# EAGLE schematic optics_r001 (EAGLE 7.7.0)
AUTHOR: Joshua Alexander; REVISION: R001
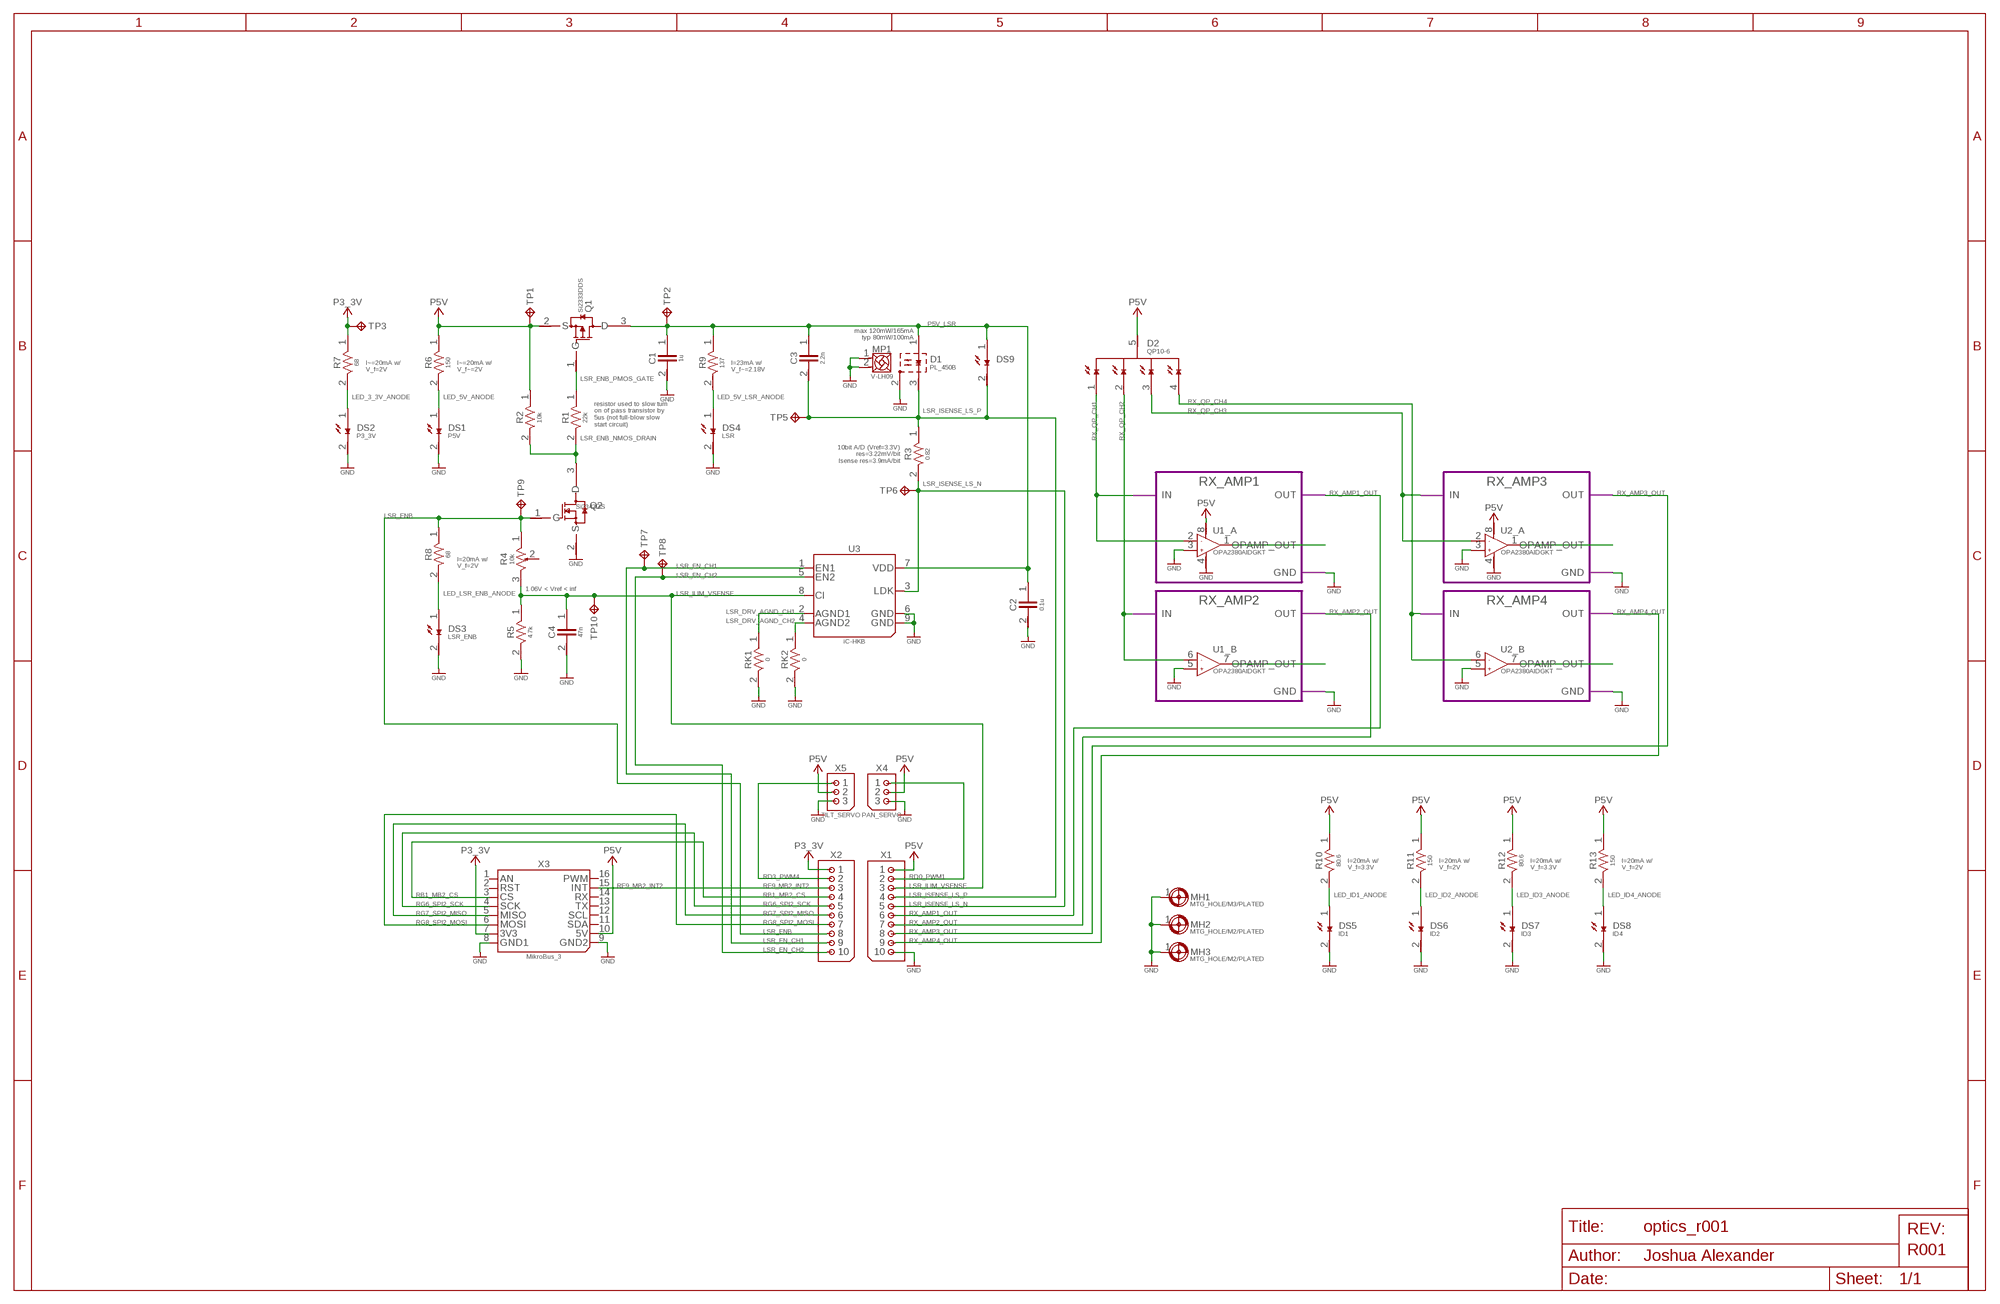
[diagram p0: schematic, sheet 1]

## Parts
C1  1u  C/10%/0805/10V  [0805_WAVE]
C2  0.1u  C/5%/0805/10V  [0805_WAVE]
C3  2.2n  C/1%/0805/10V  [0805_WAVE]
C4  47n  C/5%/0805/10V  [0805_WAVE]
D1  PL_450B  [TO38-ICUT-PL_450B]
D2  QP10-6  [TO5-QP10-6]
DS1  P5V  LED/YELLOW/1206/KINGBRIGHT  [1206_WAVE]
DS2  P3_3V  LED/YELLOW/1206/KINGBRIGHT  [1206_WAVE]
DS3  LSR_ENB  LED/RED/1206/KINGBRIGHT  [1206_WAVE]
DS4  LSR  LED/YELLOW/1206/KINGBRIGHT  [1206_WAVE]
DS5  ID1  LED/BLUE/1206/KINGBRIGHT  [1206_WAVE]
DS6  ID2  LED/RED/1206/KINGBRIGHT  [1206_WAVE]
DS7  ID3  LED/BLUE/1206/KINGBRIGHT  [1206_WAVE]
DS8  ID4  LED/YELLOW/1206/KINGBRIGHT  [1206_WAVE]
DS9  LED/BLUE/TH/5MM/CREE  [C503B-BAN/GAN/BCN/GCN]
MH1  MTG_HOLE/M3/PLATED  [M3_PLATED]
MH2  MTG_HOLE/M2/PLATED  [M2_PLATED]
MH3  MTG_HOLE/M2/PLATED  [M2_PLATED]
MP1  LENS_HOLDER/M9/LOW-PROFILE  [V-LH09]
Q1  MOSFET_P-TYPE/SI2333DDS  [SOT23-3]
Q2  MOSFET_N-TYPE/SI2342DS  [SOT23-3]
R1  22k  R/1%/0805/0.125W  [0805_WAVE]
R2  10k  R/1%/0805/0.125W  [0805_WAVE]
R3  0.82  R_SENSE/1%/1206/0.5W  [1206_WAVE]
R4  10k  R_POT/T93YB  [T93YB]
R5  4.7k  R/1%/0805/0.125W  [0805_WAVE]
R6  150  R/1%/0805/0.125W  [0805_WAVE]
R7  68  R/1%/0805/0.125W  [0805_WAVE]
R8  68  R/1%/0805/0.125W  [0805_WAVE]
R9  137  R/1%/0805/0.125W  [0805_WAVE]
R10  80.6  R/1%/0805/0.125W  [0805_WAVE]
R11  150  R/1%/0805/0.125W  [0805_WAVE]
R12  80.6  R/1%/0805/0.125W  [0805_WAVE]
R13  150  R/1%/0805/0.125W  [0805_WAVE]
RK1  0  R/1%/0805/0.125W  [0805_WAVE]
RK2  0  R/1%/0805/0.125W  [0805_WAVE]
TP1  TP/RECT_5X2.5  [PAD_RECT_5X2.5]
TP2  TP/RECT_5X2.5  [PAD_RECT_5X2.5]
TP3  TP/RECT_5X2.5  [PAD_RECT_5X2.5]
TP5  TP/CIRCLE_1.5  [PAD_CIRCLE_1.5]
TP6  TP/CIRCLE_1.5  [PAD_CIRCLE_1.5]
TP7  TP/OVAL_3X1.5  [PAD_OVAL_3X1.5]
TP8  TP/OVAL_3X1.5  [PAD_OVAL_3X1.5]
TP9  TP/CIRCLE_2  [PAD_CIRCLE_2]
TP10  TP/CIRCLE_1.5  [PAD_CIRCLE_1.5]
U1  OPA2380  [MSOP8]
U2  OPA2380  [MSOP8]
U3  iC-HKB  IC-HKB  [MSOP8-TP]
X1  HEADER-1X10/MALE/100MIL/TH/BREAKAWAY  [90120-0130]
X2  HEADER-1X10/MALE/100MIL/TH/BREAKAWAY  [90120-0130]
X3  MikroBus_3  MIKROE_BUS_CONN/SOCKET/NO_OUTLINE/COMPACT  [MIKROBUS_SOCKET_NO_OUTLINE_COMPACT]
X4  PAN_SERVO  HEADER-1X03/MALE/100MIL/TH/BREAKAWAY  [22-28-4030]
X5  TILT_SERVO  HEADER-1X03/MALE/100MIL/TH/BREAKAWAY  [22-28-4030]

## Module instances
RX_AMP1 = RX_AMP (part numbers offset by 100)
RX_AMP2 = RX_AMP (part numbers offset by 200)
RX_AMP3 = RX_AMP (part numbers offset by 300)
RX_AMP4 = RX_AMP (part numbers offset by 400)

## Nets
GND: C1.2 C2.2 C4.2 D1.2(CASE) DS1.2(C) DS2.2(C) DS3.2(C) DS4.2(C) DS5.2(C) DS6.2(C) DS7.2(C) DS8.2(C) MH1.1 MH2.1 MH3.1 MP1.1 MP1.2 Q2.2(S) R5.2 RK1.2 RK2.2 U1.3(_A:+IN) U1.4(V-) U1.5(_B:+IN) U2.3(_A:+IN) U2.4(V-) U2.5(_B:+IN) U3.6(GND) U3.9(GND) X1.10 X3.8(GND1) X3.9(GND2) X4.3 X5.3 ; port RX_AMP3.GND RX_AMP4.GND RX_AMP1.GND RX_AMP2.GND
LED_3_3V_ANODE: DS2.1(A) R7.2
LED_5V_ANODE: DS1.1(A) R6.2
LED_5V_LSR_ANODE [LSR_EN_CH]: DS4.1(A) R9.2
LED_ID1_ANODE: DS5.1(A) R10.2
LED_ID2_ANODE: DS6.1(A) R11.2
LED_ID3_ANODE: DS7.1(A) R12.2
LED_ID4_ANODE: DS8.1(A) R13.2
LED_LSR_ENB_ANODE: DS3.1(A) R8.2
LSR_DRV_AGND_CH1: RK1.1 U3.2(AGND1)
LSR_DRV_AGND_CH2: RK2.1 U3.4(AGND2)
LSR_EN_CH1 [LSR_EN_CH]: TP7.1 U3.1(EN1) X2.9
LSR_EN_CH2 [LSR_EN_CH]: TP8.1 U3.5(EN2) X2.10
LSR_ENB: Q2.1(G) R4.1 R8.1 TP9.1 X2.8
LSR_ENB_NMOS_DRAIN: Q2.3(D) R1.2 R2.2
LSR_ENB_PMOS_GATE: Q1.1(G) R1.1
LSR_ILIM_VSENSE: C4.1 R4.3 R5.1 TP10.1 U3.8(CI) X1.3
LSR_ISENSE_LS_N: R3.2 TP6.1 U3.3(LDK) X1.5
LSR_ISENSE_LS_P: C3.2 D1.3(C) DS9.2(C) R3.1 TP5.1 X1.4
P3_3V [PWR]: R7.1 TP3.1 X2.1 X3.7(3V3)
P5V [PWR]: D2.5(C) Q1.2(S) R2.1 R6.1 R10.1 R11.1 R12.1 R13.1 TP1.1 U1.8(V+) U2.8(V+) X1.1 X3.10(5V) X4.2 X5.2
P5V_LSR [PWR]: C1.1 C2.1 C3.1 D1.1(A) DS9.1(A) Q1.3(D) R9.1 TP2.1 U3.7(VDD)
RB1_MB2_CS: X2.4 X3.3(CS)
RD0_PWM1: X1.2 X4.1
RD3_PWM4: X2.2 X5.1
RE9_MB2_INT2: X2.3 X3.15(INT)
RG6_SPI2_SCK: X2.5 X3.4(SCK)
RG7_SPI2_MISO: X2.6 X3.5(MISO)
RG8_SPI2_MOSI: X2.7 X3.6(MOSI)
RX_AMP1_OUT: X1.6 ; port RX_AMP1.OUT
RX_AMP2_OUT: X1.7 ; port RX_AMP2.OUT
RX_AMP3_OUT: X1.8 ; port RX_AMP3.OUT
RX_AMP4_OUT: X1.9 ; port RX_AMP4.OUT
RX_OPAMP_OUT1: U1.1(_A:OUT) ; port RX_AMP1.OPAMP_OUT
RX_OPAMP_OUT2: U1.7(_B:OUT) ; port RX_AMP2.OPAMP_OUT
RX_OPAMP_OUT3: U2.1(_A:OUT) ; port RX_AMP3.OPAMP_OUT
RX_OPAMP_OUT4: U2.7(_B:OUT) ; port RX_AMP4.OPAMP_OUT
RX_QP_CH1 [RX_AMP_PRE]: D2.1 U1.2(_A:-IN) ; port RX_AMP1.IN
RX_QP_CH2 [RX_AMP_PRE]: D2.2 U1.6(_B:-IN) ; port RX_AMP2.IN
RX_QP_CH3 [RX_AMP_PRE]: D2.3 U2.2(_A:-IN) ; port RX_AMP3.IN
RX_QP_CH4 [RX_AMP_PRE]: D2.4 U2.6(_B:-IN) ; port RX_AMP4.IN
Unconnected: R4.2(WIPER) X3.1(AN) X3.2(RST) X3.11(SDA) X3.12(SCL) X3.13(TX) X3.14(RX) X3.16(PWM)

## Notes on the sheet
- max 120mW/165mA
  typ 80mW/100mA
- I~=20mA w/
  V_f=2V
- I~=20mA w/
  V_f~=2V
- I=23mA w/
  V_f~=2.18V
- resistor used to slow turn
  on of pass transistor by
  5us (not full-blow slow
  start circuit)
- 10bit A/D (Vref=3.3V)
  res=3.22mV/bit
  Isense res=3.9mA/bit
- I=20mA w/
  V_f=2V
- 1.06V < Vref < inf
- I=20mA w/
  V_f=3.3V
- I=20mA w/
  V_f=2V
- I=20mA w/
  V_f=3.3V
- I=20mA w/
  V_f=2V

## Library data of the parts
C1 = rcl:C; EAGLEUP: C0805;;; TOL: 10
C2 C4 = rcl:C; EAGLEUP: C0805;;; TOL: 5
C3 = rcl:C; EAGLEUP: C0805;;; TOL: 1
D1 = diode:PL_450B: Blue Single-mode Laser Diode http://www.osram-os.com/osram_os/en/products/product-catalog/laser-diodes/visible-laser/blue-laser/index.jsp; EAGLEUP: PL_450B;;; I_F: 100mA; MFR: OSRAM; MPN: PL_450B; PWR: 0.08
D2 = diode:QP10-6: Quadrant PIN photodiode (QP) http://www.first-sensor.com/en/products/optical-sensors/detectors/quadrant-pin-photodiodes-qp/; ACTIVE_AREA_PER: 2.45mm^2; EAGLEUP: QP10-6; I_PEAK: 10mA; MFR: First Sensor; MPN: QP10-6; V_MAX: 20V
DS1 DS2 DS4 DS8 = diode:LED; ANGLE: 120; EAGLEUP: LED1206_YELLOW;;; I_F: 20mA; LUM: 150mcd; MFR: Kingbright; MPN: APT3216SYCK; V_F: 2
DS3 DS6 = diode:LED; ANGLE: 120; EAGLEUP: LED1206_RED;;; I_F: 20mA; LUM: 150mcd; MFR: Kingbright; MPN: APT3216SURCK; V_F: 1.95
DS5 DS7 = diode:LED; ANGLE: 120; EAGLEUP: LED1206_BLUE;;; I_F: 20mA; LUM: 100mcd; MFR: Kingbright; MPN: APT3216QBC/D; V_F: 3.3
DS9 = diode:LED; ANGLE: 30; EAGLEUP: LED5MM_GREEN;;DNI; I_F: 30mA; LUM: 7065mcd; MFR: Cree; MPN: C503B-BCN-CV0Z0461; V_F: 3.2
MH1-MH3 = mechanical:MTG_HOLE
MP1 = mechanical:LENS_HOLDER; EAGLEUP: V-LH09;;; MFR: Marshall; MPN: V-LH09
Q1 = transistor:MOSFET_P-TYPE: P-Channel MOSFET; EAGLEUP: SOT23-3;;; MFR: Vishay; MPN: Si2333DDS; R_DS: 0.033; V_DS: -12; V_GS: 8; V_GS_TH: -0.7
Q2 = transistor:MOSFET_N-TYPE: N-Channel MOSFET; EAGLEUP: SOT23-3;;; MFR: Vishay; MPN: Si2342DS; R_DS: 0.018; V_DS: 8; V_GS: 5; V_GS_TH: 0.575
R1 R2 R5-R13 RK1 RK2 = rcl:R; EAGLEUP: R0805;;; PWR: 0.125; TOL: 1
R3 = rcl:R_SENSE; EAGLEUP: R1206;;; PWR: 0.5; TOL: 1
R4 = rcl:R_POT: Possible values: 10 22 47 100 220 470 1k 2.2k 4.7k 10k 22k 47k 100k 220k 470k 1M 2.2M; EAGLEUP: T93YB;;; MFR: Vishay; MPN: T93YB103KT20; PWR: 0.5; TOL: 10; TURNS: 19
TP1-TP3 TP5-TP10 = pad:TP
U1 U2 = ic:OPA2380: Transimpedance Amp http://www.ti.com/product/OPA2380; EAGLEUP: MSOP8;;; GBW: 90MHz; MFR: TI; MPN: OPA2380AIDGKT; VDD: 2.7-5.5
U3 = ic:IC-HK: Laser Switching Driver (155 MHz) https://www.ichaus.de/product/iC-HK%20iC-HKB; EAGLEUP: MSOP8;;; I_MAX: 300mA; MFR: iC-Haus; MPN: iC-HKB; VDD: 5
X1 X2 = io:HEADER-1X10; CIRCUITS: 10; EAGLEUP: HEADER_MALE_1X10;;; MFR: Molex; MPN: 90120-0130
X3 = io:MIKROE_BUS_CONN; CIRCUITS: 16; EAGLEUP: MIKROBUS_SOCKET;;; MFR: Molex; MPN: 90147-1108,90147-1108
X4 X5 = io:HEADER-1X03; CIRCUITS: 3; EAGLEUP: HEADER_MALE_1X03;;; MFR: Molex; MPN: 22-28-4030

## Module RX_AMP
Ports: IN(in) OPAMP_OUT(pas) OUT(out) GND(pwr)
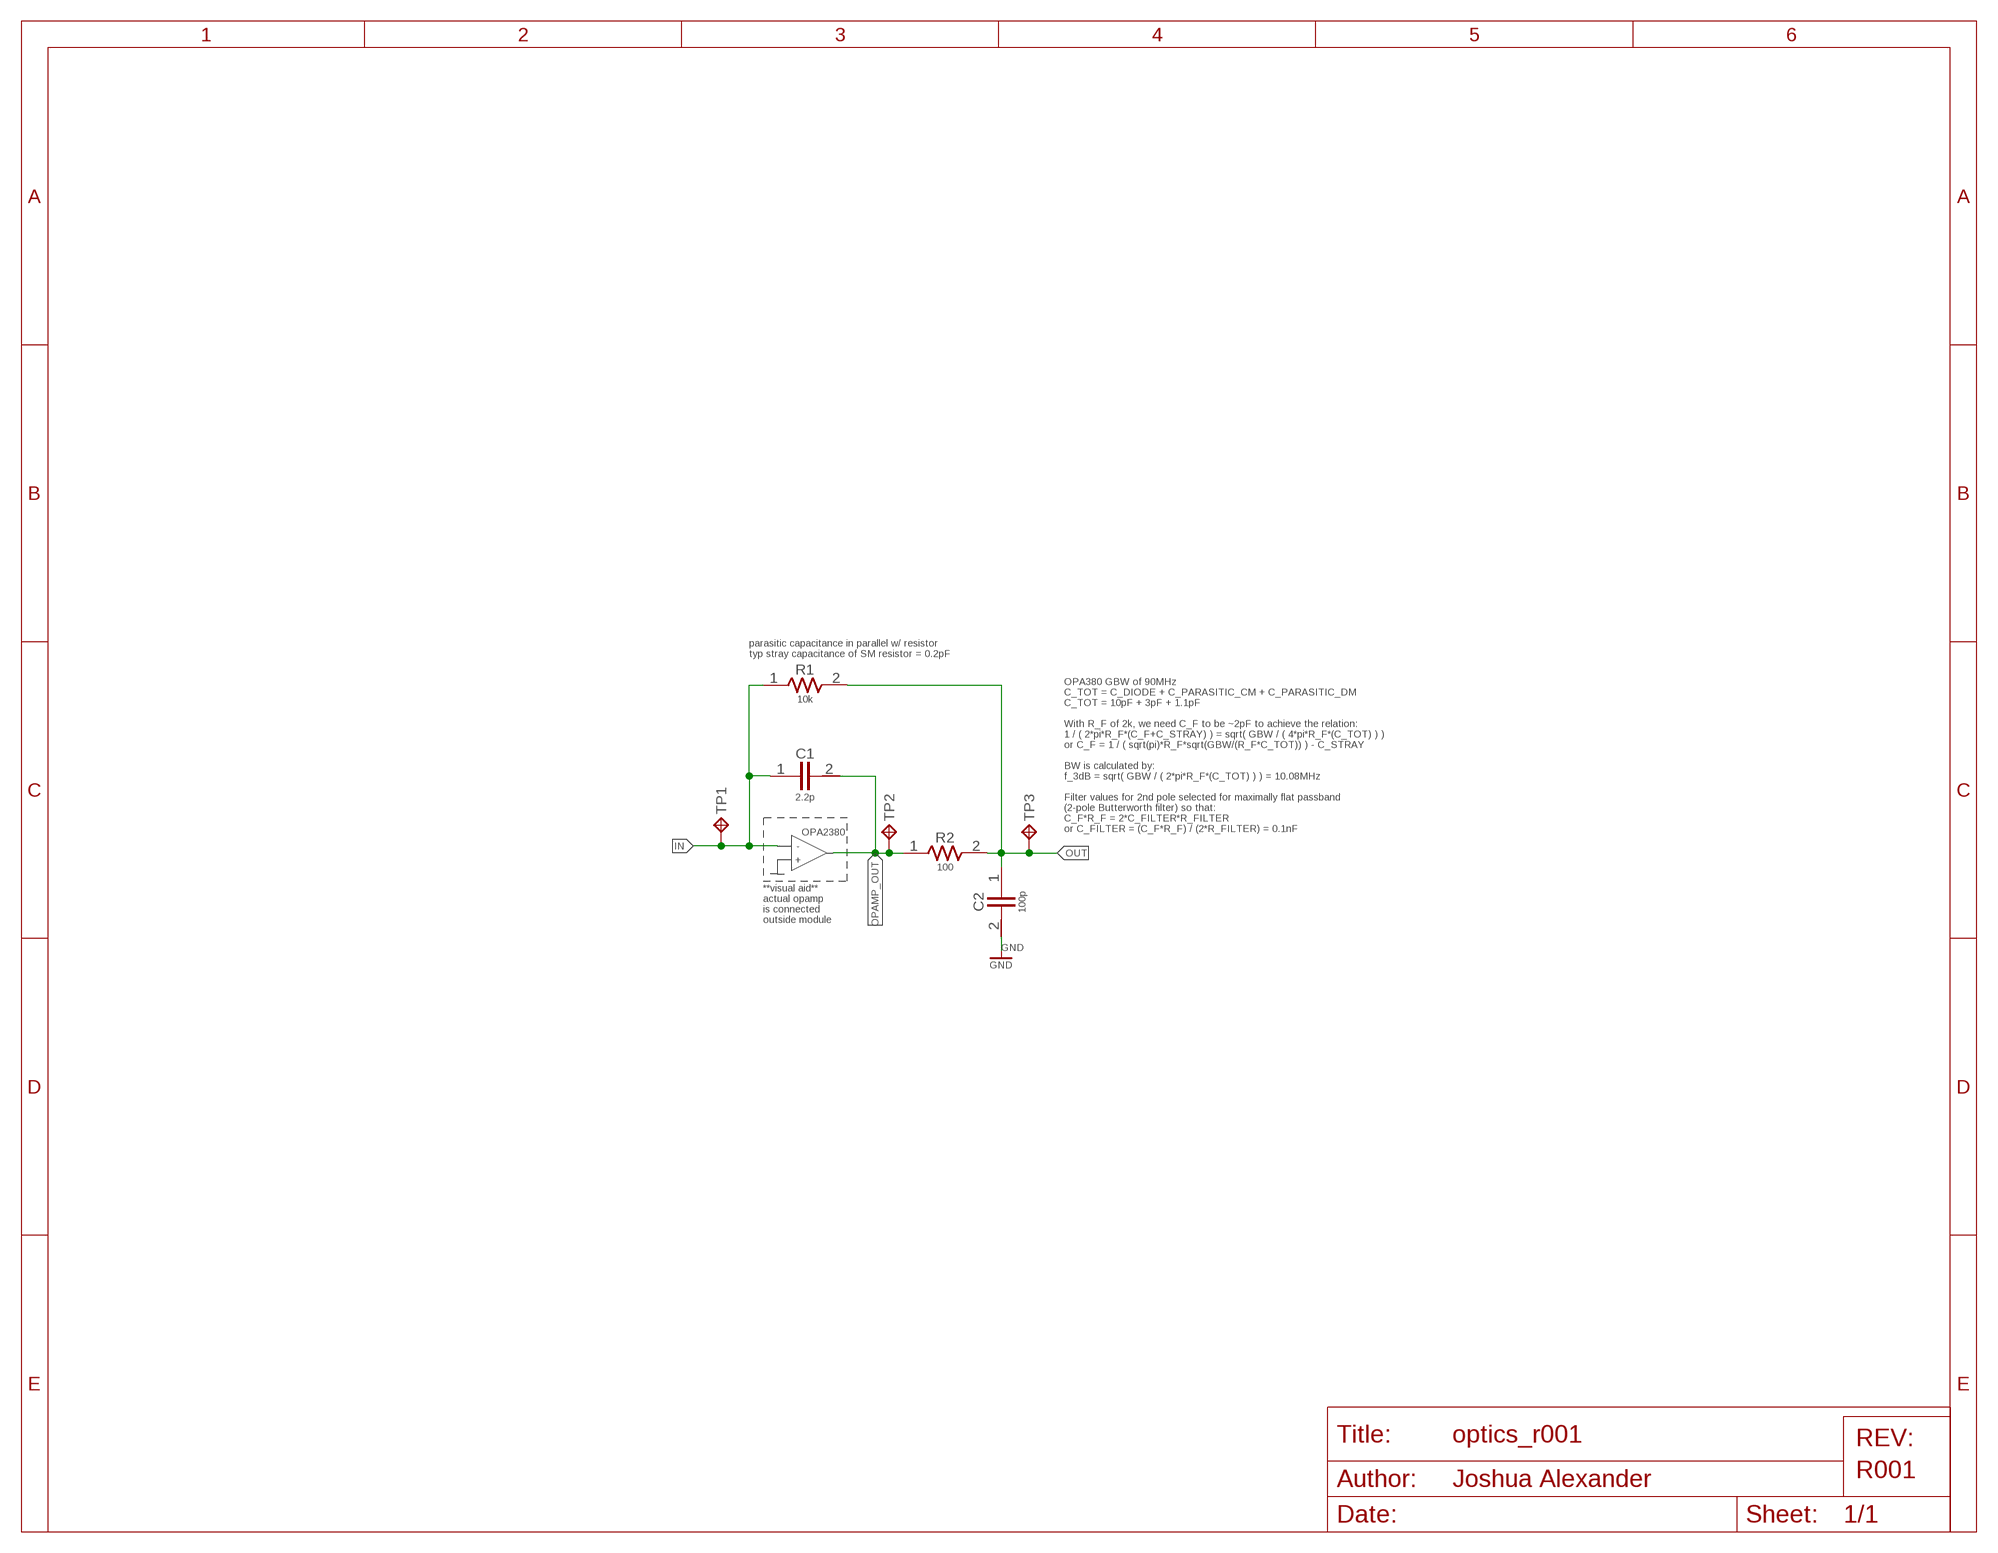
[diagram p1: schematic, module RX_AMP, sheet 1]

### Parts
C1  2.2p  C/1%/0805/10V  [0805_WAVE]
C2  100p  C/2%/0805/10V  [0805_WAVE]
R1  10k  R/1%/0805/0.125W  [0805_WAVE]
R2  100  R/1%/0805/0.125W  [0805_WAVE]
TP1  TP/CIRCLE_1.5  [PAD_CIRCLE_1.5]
TP2  TP/CIRCLE_1.5  [PAD_CIRCLE_1.5]
TP3  TP/CIRCLE_2  [PAD_CIRCLE_2]

### Nets
GND: C2.2
IN: C1.1 R1.1 TP1.1
OPAMP_OUT: C1.2 R2.1 TP2.1
OUT: C2.1 R1.2 R2.2 TP3.1

### Notes on the sheet
- parasitic capacitance in parallel w/ resistor
  typ stray capacitance of SM resistor = 0.2pF
- OPA380 GBW of 90MHz
  C_TOT = C_DIODE + C_PARASITIC_CM + C_PARASITIC_DM
  C_TOT = 10pF + 3pF + 1.1pF
   
  With R_F of 2k, we need C_F to be ~2pF to achieve the relation:
  1 / ( 2*pi*R_F*(C_F+C_STRAY) ) = sqrt( GBW / ( 4*pi*R_F*(C_TOT) ) )
  or C_F = 1 / ( sqrt(pi)*R_F*sqrt(GBW/(R_F*C_TOT)) ) - C_STRAY
   
  BW is calculated by:
  f_3dB = sqrt( GBW / ( 2*pi*R_F*(C_TOT) ) ) = 10.08MHz
   
  Filter values for 2nd pole selected for maximally flat passband 
  (2-pole Butterworth filter) so that:
  C_F*R_F = 2*C_FILTER*R_FILTER
  or C_FILTER = (C_F*R_F) / (2*R_FILTER) = 0.1nF
- OPA2380
- -
- +
- **visual aid**
  actual opamp
  is connected
  outside module

### Library data of the parts
C1 = rcl:C; EAGLEUP: C0805;;; TOL: 1
C2 = rcl:C; EAGLEUP: C0805;;; TOL: 2
R1 R2 = rcl:R; EAGLEUP: R0805;;; PWR: 0.125; TOL: 1
TP1-TP3 = pad:TP

## Net classes
0 default: width 0.203 mm, clearance 0.152 mm
1 PWR: width 0.305 mm, clearance 0.152 mm
2 RX_AMP_PRE: clearance 0.152 mm
3 LSR_EN_CH: clearance 0.152 mm